# Altium schematic sheet PMU.SchDoc: PMU
size Letter; Author: Ajay Joy; CompanyName: Tech Musketeers; DrawnBy: Ajay Joy; DocumentNumber: 1; Revision: 1; SheetNumber: 3; SheetTotal: 3
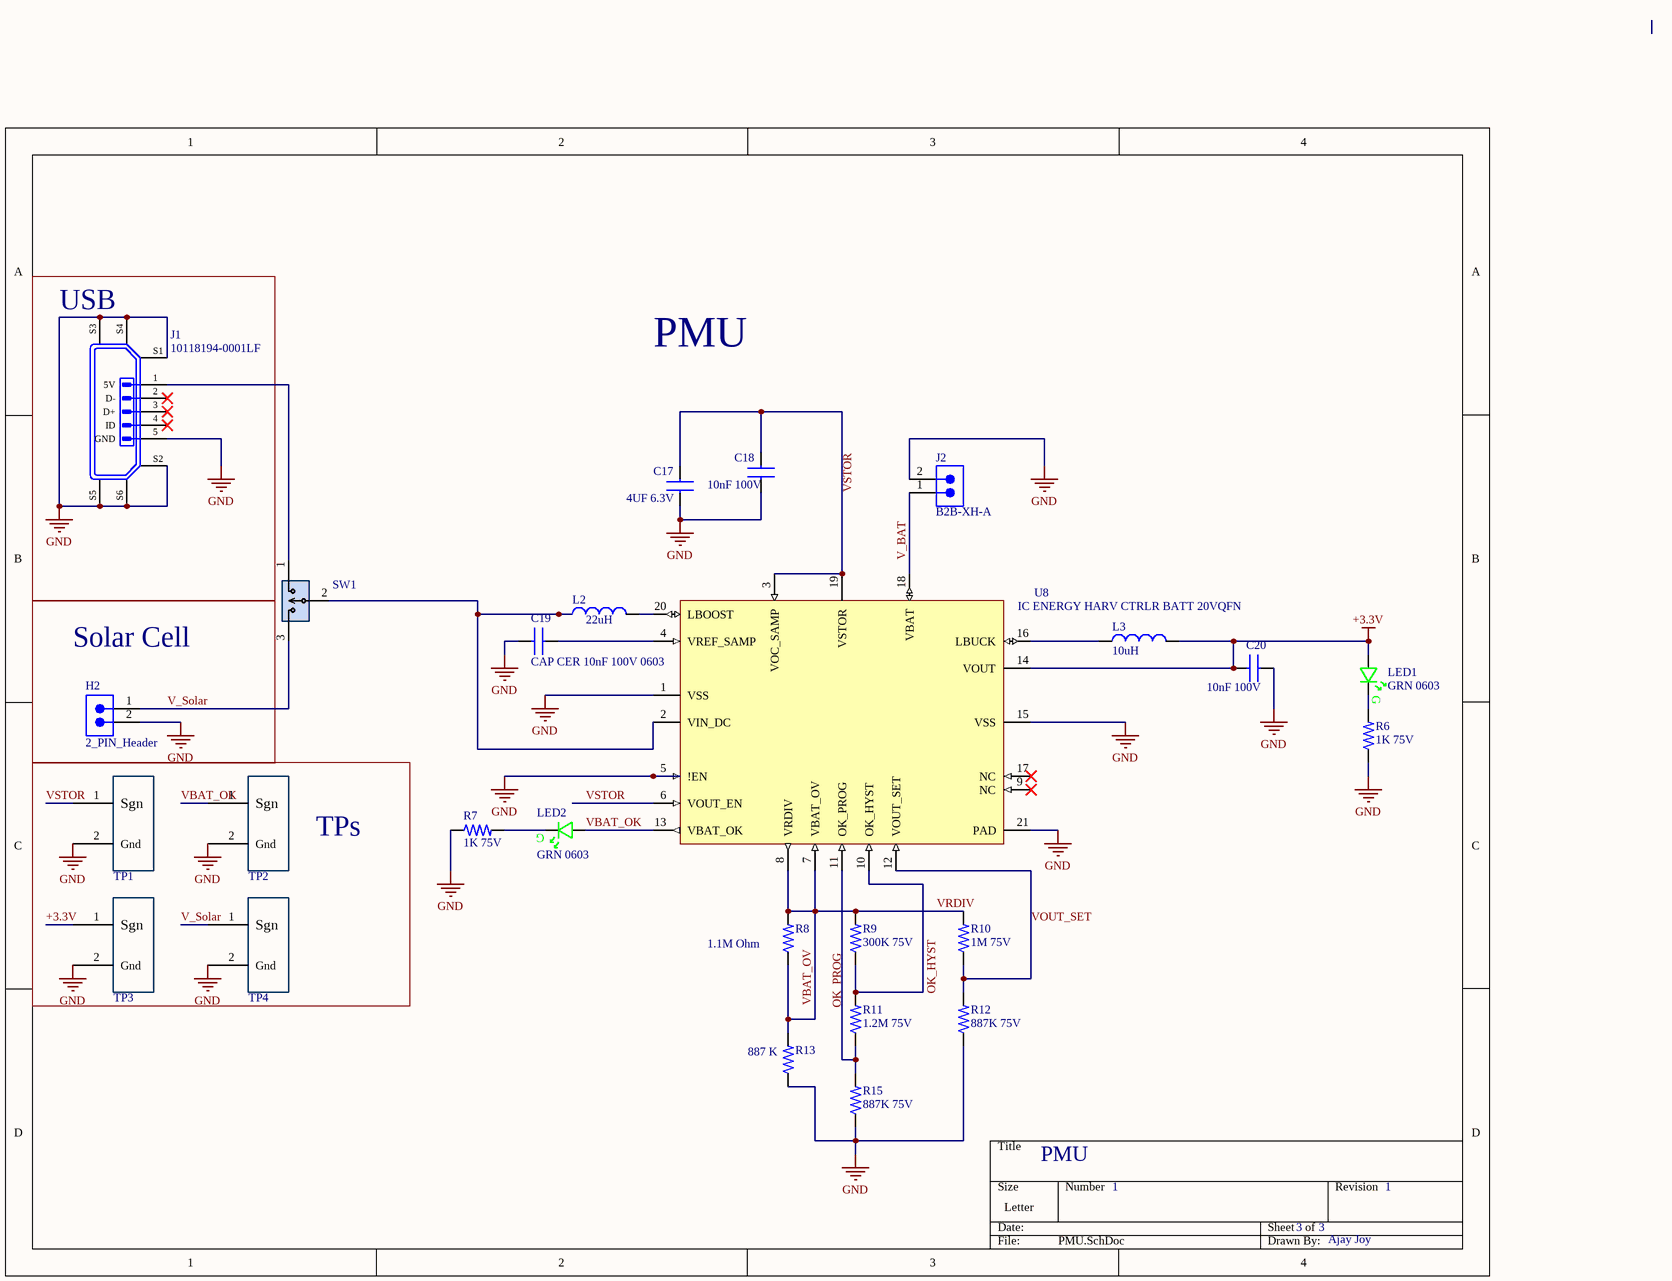
[diagram p0: PMU.SchDoc]

## Parts
C17  4UF 6.3V  [CAP_0603_1MM]
C18  10nF 100V  [CAP_0603_1MM]
C19  CAP CER 10nF 100V 0603  [CAP_0603_1MM]
C20  10nF 100V  [CAP_0603_1MM]
H2  2_PIN_Header  [2-PIN_MALE_HEADER_01-IN]
J1  Manufacturer Part Number: 10118194-0001LF  [AMPHENOL_10118194-0001LF]  (hidden comment: micro-USB)
J2  B2B-XH-A  [JST_B2B-XH-A(LF)(SN)]
L2  22uH  [IND_0603_1MM]
L3  10uH  [IND_0603_1MM]
LED1  GRN 0603  [LED_0603_GRN_WL-SMCW]
LED2  GRN 0603  [LED_0603_GRN_WL-SMCW]
R6  1K 75V  [RES_0603_1608X06]
R7  1K 75V  [RES_0603_1608X06]
R8  1.1M Ohm  [RES_0603_1608X06]
R9  300K 75V  [RES_0603_1608X06]
R10  1M 75V  [RES_0603_1608X06]
R11  1.2M 75V  [RES_0603_1608X06]
R12  887K 75V  [RES_0603_1608X06]
R13  887 K  [RES_0603_1608X06]
R15  887K 75V  [RES_0603_1608X06]
SW1  PREC003SAAN-RC  [3_PIN_100mil]  (value not drawn)
TP1  TP_Active_Probe  [Active_Probe]  (value not drawn)
TP2  TP_Active_Probe  [Active_Probe]  (value not drawn)
TP3  TP_Active_Probe  [Active_Probe]  (value not drawn)
TP4  TP_Active_Probe  [Active_Probe]  (value not drawn)
U8  IC ENERGY HARV CTRLR BATT 20VQFN  [20-VQFN_3.3x3.3_BQ25570RGRR]

## Blocks framed on the sheet
USB: J1
Solar Cell: H2
TPs: TP1-TP4

## Nets
+3.3V: C20.1 L3.2 LED1.A TP3.1(Sgn) U8.14(VOUT)
GND: C17.2 C18.2 C19.1 C20.2 H2.2 J1.5(GND) J1.S1(GND) J1.S2(GND) J1.S3(GND) J1.S4(GND) J1.S5(GND) J1.S6(GND) J2.2 R6.1 R7.1 R12.1 R13.1 R15.1 TP1.2(Gnd) TP2.2(Gnd) TP3.2(Gnd) TP4.2(Gnd) U8.1(VSS) U8.5(!EN) U8.15(VSS) U8.21(PAD)
OK_HYST: R9.1 R11.2 U8.10(OK_HYST)
V_BAT: J2.1 U8.18(VBAT)
V_Solar: H2.1 SW1.3 TP4.1(Sgn)
VBAT_OK: LED2.A TP2.1(Sgn) U8.13(VBAT_OK)
VBAT_OV: R8.1 R8.2 R9.2 R10.2 R13.2 U8.7(VBAT_OV) U8.8(VRDIV)  [also labelled VRDIV]
VOUT_SET: R10.1 R12.2 U8.12(VOUT_SET)
VSTOR: TP1.1(Sgn) U8.6(VOUT_EN)
NetC17_1: C17.1 C18.1 U8.3(VOC_SAMP) U8.19(VSTOR)
NetC19_2: C19.2 U8.4(VREF_SAMP)
NetJ1_1: J1.1(5V) SW1.1
NetL2_1: L2.1 SW1.2 U8.2(VIN_DC)
NetL2_2: L2.2 U8.20(LBOOST)
NetL3_1: L3.1 U8.16(LBUCK)
NetLED1_C: LED1.C R6.2
NetLED2_C: LED2.C R7.2
NetR11_1: R11.1 R15.2 U8.11(OK_PROG)

Not connected (* = marked no-connect by the designer): J1 2(D-)* 3(D+)* 4(ID)*; U8 9(NC)* 17(NC)*

## Notes on the sheet
- PMU
- Labels drawn without touching a wire or pin: OK_PROG, VSTOR
- (in symbol 150060GS75000) G

## Library data of the parts
C17 = CC_1uF_6.3v_0603: Ceramic Capacitor, Multilayer, Ceramic, 6.3V, 10% +Tol, 10% -Tol, X5R, 15% TC, 1uF, Surface Mount, 0603; Manufacturer: Samsung; Manufacturer Part Number: CL10A105KQ8NNNC; Multilayer: Yes; Supplier: Digikey; Supplier Part Number: 1276-1036-1-ND; RoHS: Yes; Category: Ceramic Capacitors; Stock: 375800; Pricing: 1=0.1, 10=0.027, 50=0.0156, 100=0.0121, 500=0.00908, 1000=0.00714 (USD); Mounting Technology: Surface Mount; Pins: 2; Dielectric Material: Ceramic; Package Shape: Rectangular; Case/Package: 0603; Terminal Finish: Nickel; Min Operating Temperature: -55°C; Max Operating Temperature: 85°C; JESD-609 Code: e3; Value: 1uF; Capacitor Type: Ceramic; Tolerance  (fill in as +-): 10%; Package Style: SMTMeter; Packaging: Tape and Reel; Tolerance (fill in as +-): 10%; Rated DC Voltage (URdc): 6.3V; Temperature Characteristics Code: X5R; Termination: Wraparound; Length: 1.6mm; Width: 0.8mm; Height: 0.9mm; Reach SVHC Compliant: Yes; RoHS Compliant: Yes; ComponentLink1URL: https://datasheet.ciiva.com:443/pdfs/VipMasterIC/IC/SEMS/SEMS-S-A0008521003/SEMS-S-A0008520922-1.pdf?src-supplier=IHS+Markit; ComponentLink1Description: https://datasheet.ciiva.com:443/pdfs/VipMasterIC/IC/SEMS/SEMS-S-A0008521003/SEMS-S-A0008520922-1.pdf?src-supplier=IHS+Markit; ComponentLink2URL: https://datasheet.ciiva.com/25801/cl10a105kq8nnnc-25801975.pdf?src-supplier=Digikey; ComponentLink2Description: https://datasheet.ciiva.com/25801/cl10a105kq8nnnc-25801975.pdf?src-supplier=Digikey; ComponentLink3URL: https://datasheet.ciiva.com/26838/getdatasheetpartid-355285-26838337.pdf?src-supplier=Verical; ComponentLink3Description: https://datasheet.ciiva.com/26838/getdatasheetpartid-355285-26838337.pdf?src-supplier=Verical; ComponentLink4URL: https://datasheet.ciiva.com/16199/cl10a105ko8nnnc-16199274.pdf?src-supplier=Future+Electronics; ComponentLink4Description: https://datasheet.ciiva.com/16199/cl10a105ko8nnnc-16199274.pdf?src-supplier=Future+Electronics
C18-C20 = GCM188R72A103KA37D: Ceramic Capacitor, Multilayer, Ceramic, 100V, 10% +Tol, 10% -Tol, X7R, 15% TC, 0.01uF, Surface Mount, 0603; Manufacturer: Murata; Multilayer: Yes; Reference Standard: AEC-Q200; Supplier: Digikey; Supplier Part Number: 490-4781-1-ND; Manufacturer Part Number: GCM188R72A103KA37D; RoHS: Yes; Category: Ceramic Capacitors; Stock: 6381052; Pricing: 1=0.1, 10=0.03, 50=0.0204, 100=0.0174, 500=0.0125, 1000=0.01097 (USD); Mounting Technology: Surface Mount; Pins: 2; Dielectric Material: Ceramic; Package Shape: Rectangular; Case/Package: 0603; Terminal Finish: Nickel; Min Operating Temperature: -55°C; Max Operating Temperature: 125°C; JESD-609 Code: e3; Value: 10nF; Capacitor Type: Ceramic; Tolerance  (fill in as +-): 10%; Package Style: SMTMeter; Packaging: Tape and Reel; Tolerance (fill in as +-): 10%; Rated DC Voltage (URdc): 100V; Temperature Characteristics Code: X7R; Termination: Wraparound; Length: 1.6mm; Width: 0.8mm; Height: 0.9mm; Reach SVHC Compliant: Yes; RoHS Compliant: Yes; ComponentLink1URL: https://psearch.en.murata.com:443/capacitor/product/GCM188R72A103KA37%23.pdf?src-supplier=IHS+Markit; ComponentLink1Description: https://psearch.en.murata.com:443/capacitor/product/GCM188R72A103KA37%23.pdf?src-supplier=IHS+Markit; ComponentLink2URL: https://datasheet.ciiva.com/132/product-132907.pdf?src-supplier=Digikey; ComponentLink2Description: https://datasheet.ciiva.com/132/product-132907.pdf?src-supplier=Digikey; ComponentLink3URL: https://datasheet.ciiva.com/132/product-132908.pdf?src-supplier=Digikey; ComponentLink3Description: https://datasheet.ciiva.com/132/product-132908.pdf?src-supplier=Digikey; ComponentLink4URL: https://datasheet.ciiva.com/132/product-132909.pdf?src-supplier=Digikey; ComponentLink4Description: https://datasheet.ciiva.com/132/product-132909.pdf?src-supplier=Digikey; ComponentLink5URL: https://datasheet.ciiva.com/11786/0900766b80ef92d0-11786108.pdf?src-supplier=Rs; ComponentLink5Description: https://datasheet.ciiva.com/11786/0900766b80ef92d0-11786108.pdf?src-supplier=Rs; ComponentLink6URL: https://datasheet.ciiva.com/16497/product-16497251.pdf?src-supplier=Future+Electronics; ComponentLink6Description: https://datasheet.ciiva.com/16497/product-16497251.pdf?src-supplier=Future+Electronics; ComponentLink7URL: https://datasheet.ciiva.com/18183/getdatasheetpartid-178890-18183651.pdf?src-supplier=Verical; ComponentLink7Description: https://datasheet.ciiva.com/18183/getdatasheetpartid-178890-18183651.pdf?src-supplier=Verical; ComponentLink8URL: https://datasheet.ciiva.com/11619/product-11619719.pdf?src-supplier=Avnet; ComponentLink8Description: https://datasheet.ciiva.com/11619/product-11619719.pdf?src-supplier=Avnet
H2 = PRPC002SAAN-RC: CONN HEADER VERT 2POS 2.54MM; Manufacturer: Sullins; Connector Type: Header, Unshrouded, Breakaway; Number of Positions: 2; Number of Positions Loaded: All; Pitch: 0.100" (2.54mm); Online Catalog: 0.100" (2.54mm) Pitch Connector Headers; Other Names: S9510E-02  S9510E-02-ND; Supplier 1: Digi-Key; Manufacturer Part Number: PRPC002SAAN-RC; Stock 1: 42739; Pricing 1: 1=0.08, 10=0.073, 25=0.054, 50=0.0464, 100=0.0449, 250=0.0387, 500=0.0372 (USD); Standard Package: 1; Category: Connectors, Interconnects; Family: Rectangular Connectors - Headers, Male Pins; Series: -; Packaging: Bulk; Contact Type: Male Pin; Number of Rows: 1; Row Spacing: -; Contact Mating Length: 0.230" (5.84mm); Mounting Type: Through Hole; Termination: Solder; Fastening Type: -; Features: -; Contact Finish: Gold; Contact Finish Thickness: Flash; Color: Black; ComponentLink1URL: https://media.digikey.com/PDF/Data%20Sheets/Sullins%20PDFs/xRxCzzzSxxN-RC_ST_11635-B.pdf?src-supplier=Digi-Key; ComponentLink1Description: https://media.digikey.com/PDF/Data%20Sheets/Sullins%20PDFs/xRxCzzzSxxN-RC_ST_11635-B.pdf?src-supplier=Digi-Key; Supplier Part Number 1: S1011EC-02-ND
J1 = USB-Micro B: 10118194-0001LF micro-USB paste-in-pad; Manufacturer: FCI; Number of Contacts: 5; Gender: Receptacle; Specifications: USB 2.0; Current Rating: 1.8 A; Mounting Angle: Right; Insulation Resistance: 1000 MOhms; .Creator: Kailey Shara; .SCHchecked: KS; Supplier 1: Digi-Key; RoHS: RoHS Compliant; Category: Connectors, Interconnects; Stock 1: 27978; Pricing 1: 1=0.46, 10=0.433, 25=0.3712, 50=0.3156, 100=0.3032, 250=0.27224, 500=0.25988 (USD); Packaging: Cut Tape (CT); Connector Type: USB - micro B; Mounting Type: Surface Mount, Right Angle, Horizontal; Features: Shielded, Solder Retention; Ingress Protection: -; ComponentLink1URL: http://portal.fciconnect.com/Comergent//fci/drawing/10118194.pdf; ComponentLink1Description: http://portal.fciconnect.com/Comergent//fci/drawing/10118194.pdf; Color: Black; Contact Plating: Gold; Operating Temperature Range: - 55 C to + 85 C; Product: Micro USB Type B Connectors; Termination Style: SMD; Brand: FCI; Contact Material: Copper Alloy; Flammability Rating: UL 94 V-0; Standard: USB 2.0; Standard Pack Qty: 1200; Minimum Order Quantity: 1; Reeling: True; Supplier Part Number 1: 609-4618-1-ND; .PCBchecked: KS
J2 = B2B-XH-A: Board Connector, 2 Contact(s), 1 Row(s), Male, Straight, Solder Terminal,; Manufacturer: JST; Supplier: Digikey; Supplier Part Number: 455-B2B-XH-A-ND; Manufacturer Part Number: B2B-XH-A; RoHS: Yes; Category: FFC / FPC; Stock: 691752; Pricing: 1=0.15, 10=0.122, 100=0.0898, 500=0.07432, 1000=0.06502, 5000=0.05573, 10000=0.05419 (USD); ComponentLink1URL: https://www.distrelec.biz/Web/Downloads/_t/ds/xh-series_eng_tds.pdf?mime=application%2Fpdf&src-supplier=Distrelec; ComponentLink1Description: https://www.distrelec.biz/Web/Downloads/_t/ds/xh-series_eng_tds.pdf?mime=application%2Fpdf&src-supplier=Distrelec
L2 L3 = IND_22nH_0.4OHM_300MA: 22 nH Unshielded Multilayer Inductor 300 mA 400mOhm Max 0603 (1608 Metric); Manufacturer: Tai Tech; Manufacturer Part Number: HCI1608F-22NJ-M; Supplier: DigiKey; Supplier Part Number: 4816-HCI1608F-22NJ-MCT-ND; Stock: 3940; Pricing: 1=0.1, 10=0.036, 25=0.0324, 50=0.03, 100=0.0278, 250=0.02512, 500=0.0233, 1000=0.02159 (USD)
LED1 LED2 = 150060GS75000: LED, 0603, GREEN, 430MCD, 520NM; Manufacturer: Wurth Electronics; Dynamic Catalog: 0603 Rectangle with Flat Top Chip LEDs; 3D Model: SMCW_0603.igs / SMCW_0603.stp / SMCW_0603.wrl; Wavelength - Peak: 515nm; Voltage - Forward (Vf) (Typ): 3.2V; Current - Test: 20mA; Viewing Angle: 140°; Lens Type: Clear; Lens Style/Size: Rectangle with Flat Top, 1.1mm x 0.7mm; Other Names: 732-4971-2; Supplier 1: Digi-Key; Manufacturer Part Number: 150060GS75000; Stock 1: 34964; Pricing 1: 1=0.14, 50=0.129, 100=0.11, 500=0.095 (USD); Standard Package: 4,000; Category: Optoelectronics; Family: LED Indication - Discrete; Series: WL-SMCW; Packaging: Tape & Reel (TR); Color: Green; Wavelength - Dominant: 520nm; Millicandela Rating: 430mcd; Package / Case: 0603 (1608 Metric); Size / Dimension: 1.60mm L x 0.80mm W; Height: 0.70mm; Mounting Type: Surface Mount; Online Catalog: 0603 Rectangle with Flat Top Chip LEDs; ComponentLink1URL: https://katalog.we-online.de/led/datasheet/150060GS75000.pdf?src-supplier=Digi-Key; ComponentLink1Description: https://katalog.we-online.de/led/datasheet/150060GS75000.pdf?src-supplier=Digi-Key; ComponentLink2URL: http://www.produktinfo.conrad.com/datenblaetter/750000-774999/759427-da-01-en-CHIPLED_0603_W_KL_GRUEN_150060GS75000.pdf?src-supplier=Conrad; ComponentLink2Description: http://www.produktinfo.conrad.com/datenblaetter/750000-774999/759427-da-01-en-CHIPLED_0603_W_KL_GRUEN_150060GS75000.pdf?src-supplier=Conrad; Supplier Part Number 1: 732-4971-1-ND
R6 R7 R9-R12 R15 = RMCF0603FT4K70: Fixed Resistor, Metal Glaze/thick Film, 0.1W, 4700ohm, 75V, 1% +/-Tol, 100ppm/Cel, Surface Mount, 0603; Manufacturer: Stackpole Electronics; Power: 100mW; Rated Temperature: 70°C; Value: 4.7kR; Temperature Coefficient: 100ppm/°C; Package Height: 0.45mm; Package Length: 1.55mm; Package Width: 0.8mm; Reference Standard: AEC-Q200; Supplier: Digikey; Supplier Part Number: RMCF0603FT4K70CT-ND; Manufacturer Part Number: RMCF0603FT4K70; RoHS: Yes; Category: Chip SMD Resistors; Stock: 2225898; Pricing: 1=0.1, 10=0.015, 50=0.009, 100=0.0075, 500=0.00498, 1000=0.00425 (USD); Mounting Technology: Surface Mount; Pins: 2; Package Shape: Rectangular; Case/Package: 0603; Terminal Finish: Nickel; Min Operating Temperature: -55°C; Max Operating Temperature: 155°C; Tolerance: 1%; JESD-609 Code: e3; Resistor Type: FIXED RESISTOR; Construction: Rectangular; Package Style: SMTMeter; Packaging: Tape and Reel; Technology: METAL GLAZE/THICK FILM; Termination: Wraparound; Working Voltage: 75V; Reach SVHC Compliant: Yes; RoHS Compliant: Yes; ComponentLink1URL: https://datasheet.ciiva.com:443/pdfs/VipMasterIC/IC/SEIE/SEIE-S-A0009541969/SEIE-S-A0009541969-1.pdf?src-supplier=IHS+Markit; ComponentLink1Description: https://datasheet.ciiva.com:443/pdfs/VipMasterIC/IC/SEIE/SEIE-S-A0009541969/SEIE-S-A0009541969-1.pdf?src-supplier=IHS+Markit; ComponentLink2URL: https://datasheet.ciiva.com/26835/getdatasheetpartid-486078-26835642.pdf?src-supplier=Verical; ComponentLink2Description: https://datasheet.ciiva.com/26835/getdatasheetpartid-486078-26835642.pdf?src-supplier=Verical
R8 R13 = RMCF0603FT1M10: Fixed Resistor, Metal Glaze/thick Film, 0.1W, 1100000ohm, 75V, 1% +/-Tol, 200ppm/Cel, Surface Mount, 0603; Manufacturer: Stackpole Electronics; Power: 100mW; Rated Temperature: 70°C; Value: 1.1MR; Temperature Coefficient: 200ppm/°C; Package Height: 0.45mm; Package Length: 1.55mm; Package Width: 0.8mm; Reference Standard: AEC-Q200; Supplier: Digikey; Supplier Part Number: RMCF0603FT1M10CT-ND; Manufacturer Part Number: RMCF0603FT1M10; RoHS: Yes; Category: Chip SMD Resistors; Stock: 15674; Pricing: 1=0.1, 10=0.022, 50=0.013, 100=0.0108, 500=0.00724, 1000=0.00618 (USD); Mounting Technology: Surface Mount; Pins: 2; Package Shape: Rectangular; Case/Package: 0603; Terminal Finish: Nickel; Min Operating Temperature: -55°C; Max Operating Temperature: 155°C; Tolerance: 1%; JESD-609 Code: e3; Resistor Type: FIXED RESISTOR; Construction: Rectangular; Package Style: SMTMeter; Packaging: Tape and Reel; Technology: METAL GLAZE/THICK FILM; Termination: Wraparound; Working Voltage: 75V; Reach SVHC Compliant: Yes; RoHS Compliant: Yes; ComponentLink1URL: https://datasheet.ciiva.com:443/pdfs/VipMasterIC/IC/SEIE/SEIE-S-A0009541969/SEIE-S-A0009541969-1.pdf?src-supplier=IHS+Markit; ComponentLink1Description: https://datasheet.ciiva.com:443/pdfs/VipMasterIC/IC/SEIE/SEIE-S-A0009541969/SEIE-S-A0009541969-1.pdf?src-supplier=IHS+Markit; ComponentLink2URL: https://www.seielect.com/catalog/SEI-RMCF_RMCP.pdf?src-supplier=Avnet; ComponentLink2Description: https://www.seielect.com/catalog/SEI-RMCF_RMCP.pdf?src-supplier=Avnet; ComponentLink3URL: https://www.seielect.com/Catalog/SEI-RMCF_RMCP.pdf?src-supplier=Digikey; ComponentLink3Description: https://www.seielect.com/Catalog/SEI-RMCF_RMCP.pdf?src-supplier=Digikey; ComponentLink4URL: https://www.seielect.com/catalog/sei-packaging.pdf?src-supplier=Digikey; ComponentLink4Description: https://www.seielect.com/catalog/sei-packaging.pdf?src-supplier=Digikey; ComponentLink5URL: https://datasheet.octopart.com/RMCF0603FT1M10-Stackpole-Electronics-datasheet-141193804.pdf?src-supplier=Future+Electronics; ComponentLink5Description: https://datasheet.octopart.com/RMCF0603FT1M10-Stackpole-Electronics-datasheet-141193804.pdf?src-supplier=Future+Electronics
SW1 = SW_3Pin_100mil_Switch: Connector Header Through Hole 3 position 0.100" (2.54mm); Value: CONN HEADER VERT 3POS 2.54MM; Digikey Link: https://www.digikey.com/product-detail/en/PREC003SAAN-RC/S1012EC-03-ND/2774851/?itemSeq=304982371; MFR Part #: PREC003SAAN-RC; Type: Extended; LCSC Part#: C49257
TP1-TP4 = TP_Active_Probe: Active Probe Test Point footprint
U8 = BQ25570RGRR: Power Supply Support Circuit, Adjustable, 1 Channel, PQCC20; Manufacturer: Texas Instruments; Package Body Material: Plastic; Adjustable Threshold: Yes; Number of Channels: 1; Max Supply Voltage: 5.1V; Min Supply Voltage: 100mV; Supplier: Digikey; Supplier Part Number: 296-39934-1-ND; Manufacturer Part Number: BQ25570RGRR; RoHS: Yes; Category: Battery Management; Stock: 9539; Pricing: 1=7.74, 10=5.775, 25=5.284, 100=4.7438, 250=4.48608, 500=4.3307, 1000=4.20281, 3000=4.04479 (USD); Case/Package: HVQCCN; Pins: 20; Package Shape: Square; Terminal Finish: Nickel; Min Operating Temperature: -40°C; Max Operating Temperature: 85°C; JESD-609 Code: e4; Throw Configuration: POWER SUPPLY SUPPORT CIRCUIT; Moisture Sensitivity Level: 2; Channels: 1; Package Style: CHIP CARRIER, HEAT SINK/SLUG, VERY THIN PROFILEMeter; Peak Reflow Temperature (Cel): 260°C; Surface Mount: Yes; Terminal Form: No Lead; Terminal Position: QUAD; Length: 3.5mm; Width: 3.5mm; Height - Seated (Max): 1mm; Terminal Pitch: 0.5mm; Temperature Grade: INDUSTRIAL; Reach SVHC Compliant: Yes; RoHS Compliant: Yes; ComponentLink1URL: https://www.ti.com:443/lit/ds/symlink/bq25570.pdf?src-supplier=IHS+Markit; ComponentLink1Description: https://www.ti.com:443/lit/ds/symlink/bq25570.pdf?src-supplier=IHS+Markit; ComponentLink2URL: https://datasheet.ciiva.com/29590/bq25570-29590060.pdf?src-supplier=Digikey; ComponentLink2Description: https://datasheet.ciiva.com/29590/bq25570-29590060.pdf?src-supplier=Digikey